# Altium schematic sheet Raven.SchDoc
size B
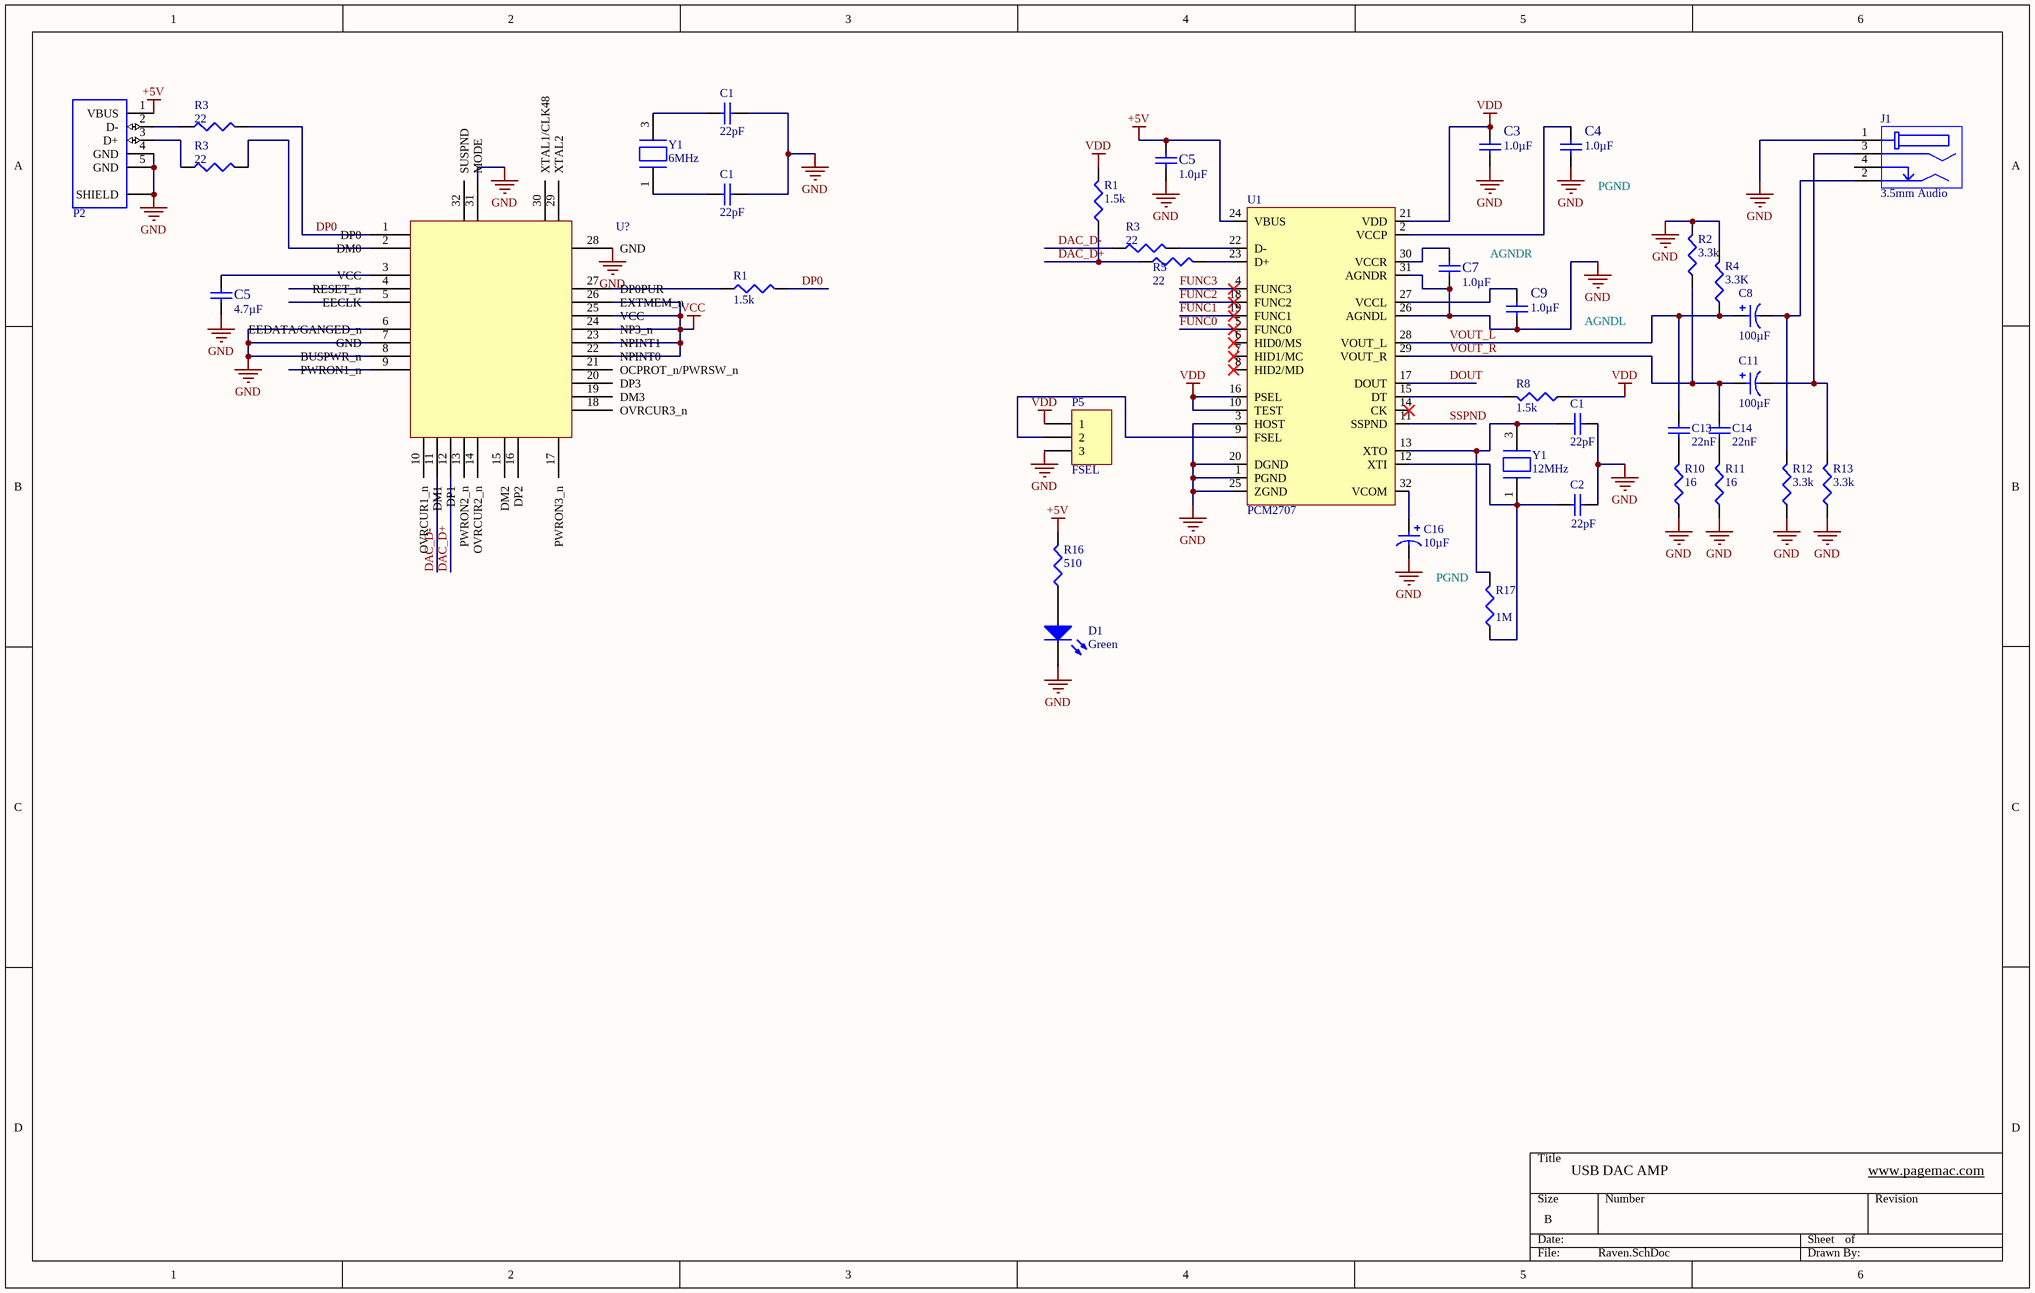
[diagram p0: Raven.SchDoc]

## Parts
(Parts that share a designator on the sheet are numbered #1, #2 ... from top to bottom, then left to right.)
C1#1  Capacitance: 22pF  [C0603]  (hidden comment: C0603C220J5GACTU)
C1#2  Capacitance: 22pF  [C0603]  (hidden comment: C0603C220J5GACTU)
C1#3  Capacitance: 22pF  [C0603]  (hidden comment: C0603C220J5GACTU)
C2  Capacitance: 22pF  [C0603]  (hidden comment: C0603C220J5GACTU)
C3  Capacitance: 1.0µF  [C0603]  (hidden comment: TMK107B7105KA-T)
C4  Capacitance: 1.0µF  [C0603]  (hidden comment: TMK107B7105KA-T)
C5#1  Capacitance: 1.0µF  [C0603]  (hidden comment: TMK107B7105KA-T)
C5#2  Capacitance: 4.7µF  [C0603]  (hidden comment: TMK107B7105KA-T)
C7  Capacitance: 1.0µF  [C0603]  (hidden comment: TMK107B7105KA-T)
C8  Capacitance: 100µF  [CAP-5mm dia]  (hidden comment: EEE-1AA101WR)
C9  Capacitance: 1.0µF  [C0603]  (hidden comment: TMK107B7105KA-T)
C11  Capacitance: 100µF  [CAP-5mm dia]  (hidden comment: EEE-1AA101WR)
C13  Capacitance2: 22nF  [C0603]  (hidden comment: C1608X7R1H223K080AA)
C14  Capacitance2: 22nF  [C0603]  (hidden comment: C1608X7R1H223K080AA)
C16  Capacitance: 10µF  [CAP-5mm dia]  (hidden comment: EEE-1HA100WR)
D1  Color: Green  [LED_0603]  (hidden comment: LTST-C190KGKT)
J1  3.5mm Audio  [AUDIO_3.5MM_SMD]
P2  10118192-0001LF  [FCI/10118192-0001LF]  (value not drawn)
P5  FSEL  [HDR1X3]
R1#1  Resistance (Ohms): 1.5k  [R0603]  (hidden comment: ERJ-3EKF1501V)
R1#2  Resistance (Ohms): 1.5k  [R0603]  (hidden comment: ERJ-3EKF1501V)
R2  Resistance (Ohms): 3.3k  [R0603]  (hidden comment: ERJ-3GEYJ332V)
R3#1  Resistance (Ohms): 22  [R0603]  (hidden comment: ERJ-3GEYJ270V)
R3#2  Resistance (Ohms): 22  [R0603]  (hidden comment: ERJ-3GEYJ270V)
R3#3  Resistance (Ohms): 22  [R0603]  (hidden comment: ERJ-3GEYJ270V)
R4  value 3.3K  [J1-0603]
R5  Resistance (Ohms): 22  [R0603]  (hidden comment: ERJ-3GEYJ270V)
R8  Resistance (Ohms): 1.5k  [R0603]  (hidden comment: ERJ-3EKF1501V)
R10  Resistance (Ohms): 16  [R0603]  (hidden comment: ERJ-3EKF16R0V)
R11  Resistance (Ohms): 16  [R0603]  (hidden comment: ERJ-3EKF16R0V)
R12  Resistance (Ohms): 3.3k  [R0603]  (hidden comment: ERJ-3GEYJ332V)
R13  Resistance (Ohms): 3.3k  [R0603]  (hidden comment: ERJ-3GEYJ332V)
R16  Resistance (Ohms): 510  [R0603]  (hidden comment: ERJ-3GEYJ511V)
R17  value 1M  [J1-0603]
U1  PCM2707  [TQFP-32]
U?  TUSB2036  [Model Name]  (value not drawn)
Y1#1  Frequency: 6MHz  [4-SMD]  (hidden comment: 403C35D12M00000)
Y1#2  Frequency: 12MHz  [4-SMD]  (hidden comment: 403C35D12M00000)

## Nets
+5V: C5#1.1 P2.1(VBUS) R16.2 U1.24(VBUS)
GND: C1#1.1 C1#2.1 C1#3.1 C2.1 C3.2 C4.2 C5#1.2 C5#2.2 C7.2 C9.1 C16.2(Anode) D1.2 J1.1 P2.4(GND) P2.5(GND) P2.6(SHIELD) P5.3 R2.2 R4.2 R10.1 R11.1 R12.1 R13.1 U1.1(PGND) U1.3(HOST) U1.20(DGND) U1.25(ZGND) U1.26(AGNDL) U1.31(AGNDR)
VDD: C3.1 P5.1 R1#1.2 R8.1 U1.10(TEST) U1.16(PSEL) U1.21(VDD)
DAC_D+: R1#1.1 R5.1
DAC_D-: R3#3.1
DOUT: U1.17(DOUT)
DP0: R1#2.2 R3#1.2
FUNC0: U1.5(FUNC0)
FUNC1: U1.19(FUNC1)
FUNC2: U1.18(FUNC2)
FUNC3: U1.4(FUNC3)
SSPND: U1.11(SSPND)
VOUT_L: C8.1(Cathode) C13.1 R4.1 U1.28(VOUT_L)
VOUT_R: C11.1(Cathode) C14.1 R2.1 U1.29(VOUT_R)
NetC1#1_2: C1#1.2 Y1#1.3
NetC1#2_2: C1#2.2 Y1#1.1
NetC1#3_2: C1#3.2 R17.2 U1.13(XTO) Y1#2.3
NetC2_2: C2.2 R17.1 U1.12(XTI) Y1#2.1
NetC4_1: C4.1 U1.2(VCCP)
NetC7_1: C7.1 U1.30(VCCR)
NetC8_2: C8.2(Anode) J1.2 R12.2
NetC9_2: C9.2 U1.27(VCCL)
NetC11_2: C11.2(Anode) J1.3 R13.2
NetC13_2: C13.2 R10.2
NetC14_2: C14.2 R11.2
NetC16_1: C16.1(Cathode) U1.32(VCOM)
NetD1_1: D1.1 R16.1
NetP2_2: P2.2(D-) R3#1.1
NetP2_3: P2.3(D+) R3#2.1
NetP5_2: P5.2 U1.9(FSEL)
NetR3#3_2: R3#3.2 U1.22(D-)
NetR5_2: R5.2 U1.23(D+)
NetR8_2: R8.2 U1.15(DT)

Not connected (* = marked no-connect by the designer): C5#2 1; J1 4; R1#2 1; R3#2 2; U1 6(HID0/MS)* 7(HID1/MC)* 8(HID2/MD)* 14(CK)*; U? 1(DP0) 2(DM0) 3(VCC) 4(RESET_n) 5(EECLK) 6(EEDATA/GANGED_n) 7(GND) 8(BUSPWR_n) 9(PWRON1_n) 10(OVRCUR1_n) 11(DM1) 12(DP1) 13(PWRON2_n) 14(OVRCUR2_n) 15(DM2) 16(DP2) 17(PWRON3_n) 18(OVRCUR3_n) 19(DM3) 20(DP3) 21(OCPROT_n/PWRSW_n) 22(NPINT0) 23(NPINT1) 24(NP3_n) 25(VCC) 26(EXTMEM_n) 27(DP0PUR) 28(GND) 29(XTAL2) 30(XTAL1/CLK48) 31(MODE) 32(SUSPND)

## Notes on the sheet
- (near C4) PGND
- AGNDR
- AGNDL
- PGND
- USB DAC AMP
- www.pagemac.com
- Labels drawn without touching a wire or pin: GND

## Library data of the parts
C1#1-C1#3 C2 = C0603C220J5GACTU: CAP CER 22PF 50V NP0 0603; Manufacturer: Kemet; Temperature Coefficient: C0G, NP0; Tolerance: ±5%; Supplier 1: Digi-Key; Supplier Part Number 1: 399-1053-1-ND; Mounting Type: Surface Mount, MLCC; Operating Temperature: -55°C ~ 125°C; Applications: General Purpose; Category: Capacitors; Features: -; Lead Style: -; Packaging: Cut Tape (CT); Thickness (Max): 0.034" (0.87mm); Lead Spacing: -; Manufacturer Part Number: C0603C220J5GACTU; Height - Seated (Max): -; Size / Dimension: 0.063" L x 0.031" W (1.60mm x 0.80mm); RoHS: RoHS Compliant; Package / Case: 0603 (1608 Metric); Ratings: -; ComponentLink1URL: http://www.kemet.com/datasheets&C0603C220J5GACTU; ComponentLink1Description: http://www.kemet.com/datasheets&C0603C220J5GACTU; Pricing 1: 10=0.083, 100=0.0297, 250=0.02144, 500=0.01584, 1000=0.01073 (USD); Stock 1: 285150; Voltage - Rated: 50V
C3 C4 C5#1 C7 C9 = TMK107B7105KA-T: CAP CER 1UF 25V 10% X7R 0603; Manufacturer: Taiyo Yuden; Supplier 1: Digi-Key; Supplier Part Number 1: 587-2984-1-ND; Manufacturer Part Number: TMK107B7105KA-T; RoHS: RoHS Compliant; Category: Capacitors; Stock 1: 27174; Pricing 1: 1=0.27, 10=0.18, 50=0.0934, 100=0.072, 250=0.05176, 500=0.0369, 1000=0.027 (USD); Tolerance: ±10%; Temperature Coefficient: X7R; Mounting Type: Surface Mount, MLCC; Operating Temperature: -55°C ~ 125°C; Applications: General Purpose; Ratings: -; Package / Case: 0603 (1608 Metric); Size / Dimension: 0.063" L x 0.031" W (1.60mm x 0.80mm); Height - Seated (Max): -; Thickness (Max): 0.035" (0.90mm); Lead Spacing: -; Features: -; Packaging: Cut Tape (CT); Lead Style: -; ComponentLink1URL: http://www.yuden.co.jp/or/product/category/capacitor/TMK107B7105KA-T.pdf; ComponentLink1Description: http://www.yuden.co.jp/or/product/category/capacitor/TMK107B7105KA-T.pdf; Voltage - Rated: 25V
C5#2 = TMK107B7105KA-T: CAP CER 4.7UF 25V 10% X7R 0603; Manufacturer: Taiyo Yuden; Supplier 1: Digi-Key; Supplier Part Number 1: 587-2984-1-ND; Manufacturer Part Number: TMK107B7105KA-T; RoHS: RoHS Compliant; Category: Capacitors; Stock 1: 27174; Pricing 1: 1=0.27, 10=0.18, 50=0.0934, 100=0.072, 250=0.05176, 500=0.0369, 1000=0.027 (USD); Tolerance: ±10%; Temperature Coefficient: X7R; Mounting Type: Surface Mount, MLCC; Operating Temperature: -55°C ~ 125°C; Applications: General Purpose; Ratings: -; Package / Case: 0603 (1608 Metric); Size / Dimension: 0.063" L x 0.031" W (1.60mm x 0.80mm); Height - Seated (Max): -; Thickness (Max): 0.035" (0.90mm); Lead Spacing: -; Features: -; Packaging: Cut Tape (CT); Lead Style: -; ComponentLink1URL: http://www.yuden.co.jp/or/product/category/capacitor/TMK107B7105KA-T.pdf; ComponentLink1Description: http://www.yuden.co.jp/or/product/category/capacitor/TMK107B7105KA-T.pdf; Voltage - Rated: 25V
C8 C11 = EEE-1AA101WR: CAP ALUM 100UF 10V 20% SMD; Manufacturer: Panasonic Electronic Components; Lifetime @ Temp.: 1000 Hrs @ 85°C; Ripple Current: 50mA; Surface Mount Land Size: 0.209" L x 0.209" W (5.30mm x 5.30mm); Supplier 1: Digi-Key; Supplier Part Number 1: PCE3867CT-ND; Manufacturer Part Number: EEE-1AA101WR; RoHS: RoHS Compliant; Category: Capacitors; Stock 1: 34068; Pricing 1: 1=0.44, 10=0.345, 25=0.2904, 50=0.249, 100=0.2076, 250=0.15568, 500=0.13284 (USD); Packaging: Cut Tape (CT); Tolerance: ±20%; Voltage Rating: 10V; ESR (Equivalent Series Resistance): -; Operating Temperature: -40°C ~ 85°C; Type: -; Applications: Automotive; Impedance: -; Lead Spacing: -; Size / Dimension: 0.197" Dia (5.00mm); Height - Seated (Max): 0.213" (5.40mm); Mounting Type: Surface Mount; Package / Case: Radial, Can - SMD; ComponentLink1URL: http://industrial.panasonic.com/www-cgi/jvcr13pz.cgi?E+PZ+3+ABA0002+EEE1AA101WR+7+WW; ComponentLink1Description: http://industrial.panasonic.com/www-cgi/jvcr13pz.cgi?E+PZ+3+ABA0002+EEE1AA101WR+7+WW
C13 C14 = C1608X7R1H223K080AA: CAP CER 0.022UF 50V 10% X7R 0603; Manufacturer: TDK Corporation; Capacitance: 0.022µF; Supplier 1: Digi-Key; Supplier Part Number 1: 445-1312-1-ND; Manufacturer Part Number: C1608X7R1H223K080AA; RoHS: RoHS Compliant; Category: Capacitors; Stock 1: 257745; Pricing 1: 1=0.1, 10=0.04, 100=0.0185, 250=0.01516, 500=0.01296, 1000=0.0099 (USD); Packaging: Cut Tape (CT); Tolerance: ±10%; Voltage - Rated: 50V; Temperature Coefficient: X7R; Mounting Type: Surface Mount, MLCC; Operating Temperature: -55°C ~ 125°C; Applications: General Purpose; Ratings: -; Package / Case: 0603 (1608 Metric); Size / Dimension: 0.063" L x 0.031" W (1.60mm x 0.80mm); Height - Seated (Max): -; Thickness (Max): 0.037" (0.95mm); Lead Spacing: -; Features: -; Lead Style: -; ComponentLink1URL: http://product.tdk.com/en/catalog/datasheets/mlcc_commercial_general_en.pdf; ComponentLink1Description: http://product.tdk.com/en/catalog/datasheets/mlcc_commercial_general_en.pdf
C16 = EEE-1HA100WR: CAP ALUM 10UF 50V 20% SMD; Manufacturer: Panasonic Electronic Components; Lifetime @ Temp.: 1000 Hrs @ 85°C; Ripple Current: 27mA; Surface Mount Land Size: 0.209" L x 0.209" W (5.30mm x 5.30mm); Supplier 1: Digi-Key; Supplier Part Number 1: PCE3915CT-ND; Manufacturer Part Number: EEE-1HA100WR; RoHS: RoHS Compliant; Category: Capacitors; Stock 1: 3860; Pricing 1: 1=0.44, 10=0.345, 25=0.2904, 50=0.249, 100=0.2076, 250=0.15568, 500=0.13284 (USD); Packaging: Cut Tape (CT); Tolerance: ±20%; Voltage Rating: 50V; ESR (Equivalent Series Resistance): -; Operating Temperature: -40°C ~ 85°C; Type: -; Applications: Automotive; Impedance: -; Lead Spacing: -; Size / Dimension: 0.197" Dia (5.00mm); Height - Seated (Max): 0.213" (5.40mm); Mounting Type: Surface Mount; Package / Case: Radial, Can - SMD; ComponentLink1URL: http://industrial.panasonic.com/www-cgi/jvcr13pz.cgi?E+PZ+3+ABA0002+EEE1HA100WR+7+WW; ComponentLink1Description: http://industrial.panasonic.com/www-cgi/jvcr13pz.cgi?E+PZ+3+ABA0002+EEE1HA100WR+7+WW
D1 = LTST-C190KGKT: LED GREEN CLEAR 0603 SMD; Manufacturer: Lite-On Inc; Wavelength - Dominant: 571nm; Wavelength - Peak: 574nm; Millicandela Rating: 35mcd; Voltage - Forward (Vf) Typ: 2V; Current - Test: 20mA; Viewing Angle: 130°; Lens Style/Size: Rectangle with Flat Top, 1.06mm x 0.8mm; Supplier 1: Digi-Key; Manufacturer Part Number: LTST-C190KGKT; RoHS: RoHS Compliant; Category: Optoelectronics; Stock 1: 280483; Pricing 1: 1=0.29, 10=0.228, 100=0.1242, 250=0.0828, 500=0.07038, 1000=0.05382 (USD); Packaging: Cut Tape (CT); Lens Type: Clear; Package / Case: 0603 (1608 Metric); Size / Dimension: 1.60mm L x 0.80mm W; Height: 0.80mm; Mounting Type: Surface Mount; Luminous Flux @ Current - Test: -; ComponentLink1URL: http://optoelectronics.liteon.com/en-us/api/DwonloadFileHandler.ashx?txtSpecNo=DS22-2000-074&txtPartNo=LTST-C190KGKT; ComponentLink1Description: http://optoelectronics.liteon.com/en-us/api/DwonloadFileHandler.ashx?txtSpecNo=DS22-2000-074&txtPartNo=LTST-C190KGKT; Supplier Part Number 1: 160-1435-1-ND
J1 = SJ-3524-SMT-TR: CONN AUDIO JACK 3.5MM STEREO SMD; Manufacturer: CUI Inc; Connector Type: Phone Jack; Gender: Female; Plug/Mating Plug Diameter: 3.50mm (0.141", 1/8", Mini Plug) - Headphone; Number of Positions/Contacts: 3 Conductors, 4 Contacts; Internal Switch(s): Single Switch; Shielding: Unshielded; Color - Contact: Black; Voltage - Rated: 12VDC; Current Rating: 1A; Supplier 1: Digi-Key; Supplier Part Number 1: CP-3524SJCT-ND; Manufacturer Part Number: SJ-3524-SMT-TR; RoHS: RoHS Compliant; Category: Connectors, Interconnects; Stock 1: 65757; Pricing 1: 1=1.37, 10=1.063, 100=0.811, 500=0.64746 (USD); Packaging: Cut Tape (CT); Signal Lines: Stereo; Mounting Type: Surface Mount, Right Angle; Termination: Solder; Features: -; Contact Material: Brass; Contact Material - Plating: Silver; Housing Material: Plastic; Housing Color: Black; Operating Temperature: -25°C ~ 85°C; ComponentLink1URL: http://www.cui.com/product/resource/digikeypdf/sj-352x-smt_series.pdf; ComponentLink1Description: http://www.cui.com/product/resource/digikeypdf/sj-352x-smt_series.pdf
P2 = 10118192-0001LF: CONN USB MICRO B RECPT SMT R/A; Manufacturer: FCI; Connector Type: USB - micro B; Number of Contacts: 5; Gender: Receptacle; Specifications: USB 2.0; Supplier 1: Digi-Key; Manufacturer Part Number: 10118192-0001LF; RoHS: RoHS Compliant; Category: Connectors, Interconnects; Stock 1: 15554; Pricing 1: 1=0.46, 10=0.433, 25=0.3712, 50=0.3156, 100=0.3032, 250=0.27224, 500=0.25988 (USD); Packaging: Cut Tape (CT); Mounting Type: Surface Mount, Right Angle, Horizontal; Features: Shielded, Solder Retention; Ingress Protection: -; ComponentLink1URL: http://portal.fciconnect.com/Comergent//fci/drawing/10118192.pdf; ComponentLink1Description: http://portal.fciconnect.com/Comergent//fci/drawing/10118192.pdf; Supplier Part Number 1: 609-4613-1-ND
P5 = Header 3: Header, 3-Pin; LatestRevisionDate: 17-Jul-2002; LatestRevisionNote: Re-released for DXP Platform.; Publisher: Altium Limited
R1#1 R1#2 R8 = ERJ-3EKF1501V: RES 1.5K OHM 1% 1/10W 0603 SMD; Manufacturer: Panasonic Electronic Components; Power (Watts): 0.1W, 1/10W; Temperature Coefficient: ±100ppm/°C; Supplier 1: Digi-Key; Supplier Part Number 1: P1.50KHCT-ND; Manufacturer Part Number: ERJ-3EKF1501V; RoHS: RoHS Compliant; Category: Resistors; Stock 1: 626603; Pricing 1: 1=0.1, 50=0.015, 100=0.0114, 250=0.00844, 500=0.00624, 1000=0.00416, 2500=0.00351 (USD); Packaging: Cut Tape (CT); Tolerance: ±1%; Composition: Thick Film; Features: Automotive AEC-Q200; Operating Temperature: -55°C ~ 155°C; Package / Case: 0603 (1608 Metric); Supplier Device Package: 0603; Size / Dimension: 0.063" L x 0.031" W (1.60mm x 0.80mm); Height: 0.022" (0.55mm); Number of Terminations: 2; ComponentLink1URL: http://industrial.panasonic.com/www-cgi/jvcr13pz.cgi?E+PZ+3+AOA0002+ERJ3EKF1501V+7+WW; ComponentLink1Description: http://industrial.panasonic.com/www-cgi/jvcr13pz.cgi?E+PZ+3+AOA0002+ERJ3EKF1501V+7+WW
R2 R12 R13 = ERJ-3GEYJ332V: RES 3.3K OHM 5% 1/10W 0603 SMD; Manufacturer: Panasonic Electronic Components; Power (Watts): 0.1W, 1/10W; Temperature Coefficient: ±200ppm/°C; Supplier 1: Digi-Key; Supplier Part Number 1: P3.3KGCT-ND; Manufacturer Part Number: ERJ-3GEYJ332V; RoHS: RoHS Compliant; Category: Resistors; Stock 1: 491357; Pricing 1: 1=0.1, 50=0.0126, 100=0.0096, 250=0.00716, 500=0.00528, 1000=0.00352, 2500=0.00297 (USD); Packaging: Cut Tape (CT); Tolerance: ±5%; Composition: Thick Film; Features: Automotive AEC-Q200; Operating Temperature: -55°C ~ 155°C; Package / Case: 0603 (1608 Metric); Supplier Device Package: 0603; Size / Dimension: 0.063" L x 0.031" W (1.60mm x 0.80mm); Height: 0.022" (0.55mm); Number of Terminations: 2; ComponentLink1URL: http://industrial.panasonic.com/www-cgi/jvcr13pz.cgi?E+PZ+3+AOA0001+ERJ3GEYJ332V+7+WW; ComponentLink1Description: http://industrial.panasonic.com/www-cgi/jvcr13pz.cgi?E+PZ+3+AOA0001+ERJ3GEYJ332V+7+WW
R3#1-R3#3 R5 = ERJ-3GEYJ270V: RES 27 OHM 1/10W 5% 0603 SMD; Manufacturer: Panasonic Electronic Components; Power (Watts): 0.1W, 1/10W; Temperature Coefficient: ±200ppm/°C; Supplier 1: Digi-Key; Manufacturer Part Number: ERJ-3GEYJ270V; RoHS: RoHS Compliant; Category: Resistors; Stock 1: 276758; Pricing 1: 1=0.1, 50=0.0126, 100=0.0096, 250=0.00716, 500=0.00528, 1000=0.00352, 2500=0.00297 (USD); Packaging: Cut Tape (CT); Tolerance: ±5%; Composition: Thick Film; Features: -; Package / Case: 0603 (1608 Metric); Supplier Device Package: 0603; Size / Dimension: 0.063" L x 0.031" W (1.60mm x 0.80mm); Height: 0.022" (0.55mm); Number of Terminations: 2; ComponentLink1URL: http://industrial.panasonic.com/www-cgi/jvcr13pz.cgi?E+PZ+3+AOA0001+ERJ3GEYJ270V+7+WW; ComponentLink1Description: http://industrial.panasonic.com/www-cgi/jvcr13pz.cgi?E+PZ+3+AOA0001+ERJ3GEYJ270V+7+WW; Supplier Part Number 1: P27GCT-ND
R4 R17 = Res3: Resistor; Published: 8-Jun-2000; LatestRevisionDate: 29-May-2009; LatestRevisionNote: IPC-7351 Footprint Added.; PackageReference: J1-0603; Publisher: Altium Limited; PackageDescription: Chip Resistor
R10 R11 = ERJ-3EKF16R0V: RES 16 OHM 1% 1/10W 0603 SMD; Manufacturer: Panasonic Electronic Components; Power (Watts): 0.1W, 1/10W; Temperature Coefficient: ±100ppm/°C; Supplier 1: Digi-Key; Supplier Part Number 1: P16.0HCT-ND; Manufacturer Part Number: ERJ-3EKF16R0V; RoHS: RoHS Compliant; Category: Resistors; Stock 1: 24770; Pricing 1: 1=0.1, 50=0.015, 100=0.0114, 250=0.00844, 500=0.00624, 1000=0.00416, 2500=0.00351 (USD); Packaging: Cut Tape (CT); Tolerance: ±1%; Composition: Thick Film; Features: Automotive AEC-Q200; Operating Temperature: -55°C ~ 155°C; Package / Case: 0603 (1608 Metric); Supplier Device Package: 0603; Size / Dimension: 0.063" L x 0.031" W (1.60mm x 0.80mm); Height: 0.022" (0.55mm); Number of Terminations: 2; ComponentLink1URL: http://industrial.panasonic.com/www-cgi/jvcr13pz.cgi?E+PZ+3+AOA0002+ERJ3EKF16R0V+7+WW; ComponentLink1Description: http://industrial.panasonic.com/www-cgi/jvcr13pz.cgi?E+PZ+3+AOA0002+ERJ3EKF16R0V+7+WW
R16 = ERJ-3GEYJ511V: RES 510 OHM 1/10W 5% 0603 SMD; Manufacturer: Panasonic Electronic Components; Power (Watts): 0.1W, 1/10W; Temperature Coefficient: ±200ppm/°C; Supplier 1: Digi-Key; Manufacturer Part Number: ERJ-3GEYJ511V; RoHS: RoHS Compliant; Category: Resistors; Stock 1: 193639; Pricing 1: 1=0.1, 50=0.0126, 100=0.0096, 250=0.00716, 500=0.00528, 1000=0.00352, 2500=0.00297 (USD); Packaging: Cut Tape (CT); Tolerance: ±5%; Composition: Thick Film; Features: -; Package / Case: 0603 (1608 Metric); Supplier Device Package: 0603; Size / Dimension: 0.063" L x 0.031" W (1.60mm x 0.80mm); Height: 0.022" (0.55mm); Number of Terminations: 2; ComponentLink1URL: http://industrial.panasonic.com/www-cgi/jvcr13pz.cgi?E+PZ+3+AOA0001+ERJ3GEYJ511V+7+WW; ComponentLink1Description: http://industrial.panasonic.com/www-cgi/jvcr13pz.cgi?E+PZ+3+AOA0001+ERJ3GEYJ511V+7+WW; Supplier Part Number 1: P510GCT-ND
U1 = PCM2707PJTR: IC DAC 16BIT STEREO W/USB 32TQFP; Manufacturer: Texas Instruments; Supplier 1: Digi-Key; Supplier Part Number 1: 296-31709-1-ND; Manufacturer Part Number: PCM2707PJTR; RoHS: RoHS Compliant; Category: Integrated Circuits (ICs); Stock 1: 790; Pricing 1: 1=9.38, 10=8.436, 25=7.672, 100=6.9448, 250=6.363, 500=5.8176, 750=5.34492, 1000=4.545 (USD); Packaging: Cut Tape (CT); Type: DAC, USB; Applications: USB Audio; Mounting Type: Surface Mount; Package / Case: 32-TQFP; Supplier Device Package: 32-TQFP (7x7); ComponentLink1URL: http://www.ti.com/lit/ds/symlink/pcm2707.pdf; ComponentLink1Description: http://www.ti.com/lit/ds/symlink/pcm2707.pdf
U? = TUSB2036: IC 2/3-PORT USB HUB 32-LQFP
Y1#1 Y1#2 = 403C35D12M00000: CRYSTAL 12MHZ 18PF SMD; Manufacturer: CTS-Frequency Controls; Frequency Stability: ±50ppm; Frequency Tolerance: ±30ppm; ESR (Equivalent Series Resistance): 150 Ohm; Operating Mode: Fundamental; Supplier 1: Digi-Key; Supplier Part Number 1: CTX839CT-ND; Manufacturer Part Number: 403C35D12M00000; RoHS: RoHS Compliant; Category: Crystals and Oscillators; Stock 1: 14107; Pricing 1: 1=0.79, 10=0.702, 50=0.6554, 100=0.58, 500=0.5481, 1000=0.4582 (USD); Packaging: Cut Tape (CT); Type: MHz Crystal; Load Capacitance: 18pF; Operating Temperature: -20°C ~ 70°C; Ratings: -; Mounting Type: Surface Mount; Package / Case: 4-SMD, No Lead (DFN, LCC); Size / Dimension: 0.126" L x 0.098" W (3.20mm x 2.50mm); Height: 0.031" (0.80mm); ComponentLink1URL: http://www.ctscorp.com/components/Datasheets/008-0288-0_F.pdf; ComponentLink1Description: http://www.ctscorp.com/components/Datasheets/008-0288-0_F.pdf